# EAGLE schematic binary_watch_v0 (EAGLE 6.5.0)
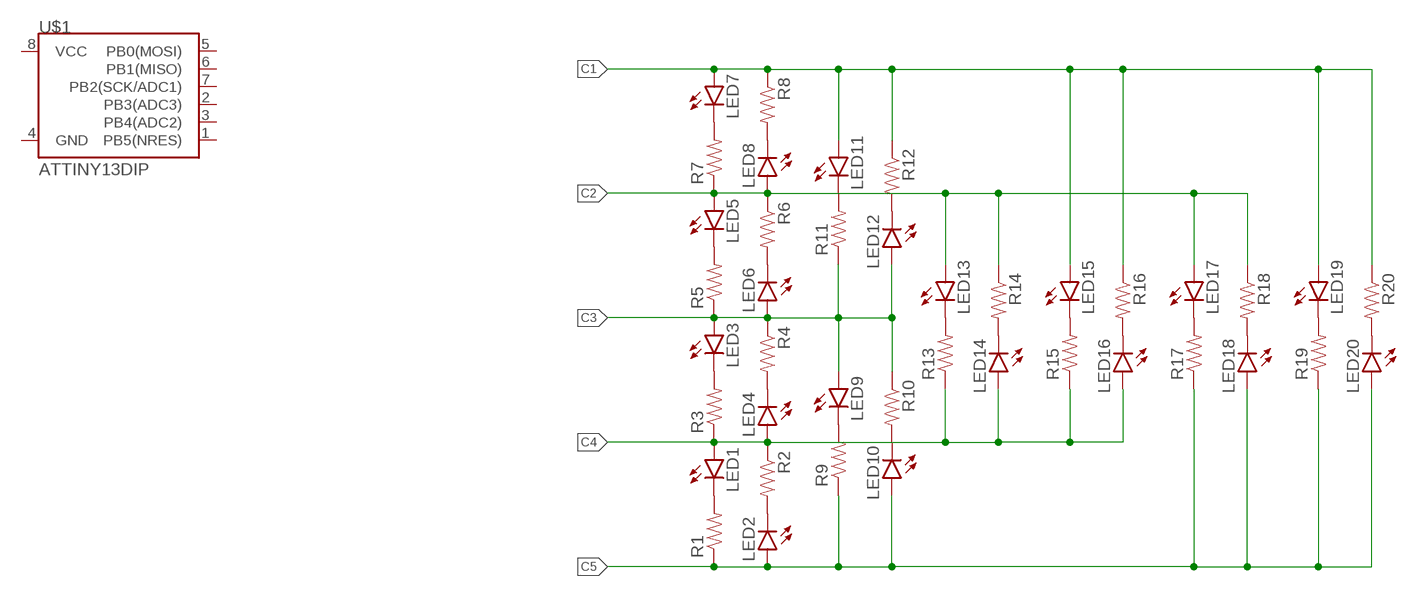
[diagram p0: schematic, sheet 1]

## Parts
LED1  LED0603  [LED-0603]
LED2  LED0603  [LED-0603]
LED3  LED0603  [LED-0603]
LED4  LED0603  [LED-0603]
LED5  LED0603  [LED-0603]
LED6  LED0603  [LED-0603]
LED7  LED0603  [LED-0603]
LED8  LED0603  [LED-0603]
LED9  LED0603  [LED-0603]
LED10  LED0603  [LED-0603]
LED11  LED0603  [LED-0603]
LED12  LED0603  [LED-0603]
LED13  LED0603  [LED-0603]
LED14  LED0603  [LED-0603]
LED15  LED0603  [LED-0603]
LED16  LED0603  [LED-0603]
LED17  LED0603  [LED-0603]
LED18  LED0603  [LED-0603]
LED19  LED0603  [LED-0603]
LED20  LED0603  [LED-0603]
R1  RESISTOR0603-RES  [0603-RES]
R2  RESISTOR0603-RES  [0603-RES]
R3  RESISTOR0603-RES  [0603-RES]
R4  RESISTOR0603-RES  [0603-RES]
R5  RESISTOR0603-RES  [0603-RES]
R6  RESISTOR0603-RES  [0603-RES]
R7  RESISTOR0603-RES  [0603-RES]
R8  RESISTOR0603-RES  [0603-RES]
R9  RESISTOR0603-RES  [0603-RES]
R10  RESISTOR0603-RES  [0603-RES]
R11  RESISTOR0603-RES  [0603-RES]
R12  RESISTOR0603-RES  [0603-RES]
R13  RESISTOR0603-RES  [0603-RES]
R14  RESISTOR0603-RES  [0603-RES]
R15  RESISTOR0603-RES  [0603-RES]
R16  RESISTOR0603-RES  [0603-RES]
R17  RESISTOR0603-RES  [0603-RES]
R18  RESISTOR0603-RES  [0603-RES]
R19  RESISTOR0603-RES  [0603-RES]
R20  RESISTOR0603-RES  [0603-RES]
U$1  ATTINY13DIP  [DIP08]

## Nets
C1: LED7.A LED11.A LED15.A LED19.A R8.1 R12.1 R16.1 R20.1
C2: LED5.A LED8.A LED13.A LED17.A R6.1 R7.1 R14.1 R18.1
C3: LED3.A LED6.A LED9.A LED12.A R4.1 R5.1 R10.1 R11.1
C4: LED1.A LED4.A LED14.A LED16.A R2.1 R3.1 R13.1 R15.1
C5: LED2.A LED10.A LED18.A LED20.A R1.1 R9.1 R17.1 R19.1
N$1: LED1.C R1.2
N$2: LED2.C R2.2
N$3: LED3.C R3.2
N$4: LED4.C R4.2
N$5: LED5.C R5.2
N$6: LED6.C R6.2
N$7: LED8.C R8.2
N$8: LED7.C R7.2
N$9: LED9.C R9.2
N$10: LED10.C R10.2
N$11: LED11.C R11.2
N$12: LED12.C R12.2
N$13: LED13.C R13.2
N$14: LED14.C R14.2
N$15: LED15.C R15.2
N$17: LED16.C R16.2
N$24: LED17.C R17.2
N$25: LED18.C R18.2
N$28: LED19.C R19.2
N$29: LED20.C R20.2
Unconnected: U$1.1(PB5(NRES)) U$1.2(PB3(ADC3)) U$1.3(PB4(ADC2)) U$1.4(GND) U$1.5(PB0(MOSI)) U$1.6(PB1(MISO)) U$1.7(PB2(SCK/ADC1)) U$1.8(VCC)

## Library data of the parts
LED1-LED20 = SparkFun-LED:LED: LEDs Standard schematic elements and footprints for 5mm, 3mm, 1206, and 0603 sized LEDs. 5mm - Spark Fun Electronics SKU : COM-00529 (and others)
R1-R20 = SparkFun-Resistors:RESISTOR: Resistor Basic schematic elements and footprints for 0603, 1206, and PTH resistors.
U$1 = SparkFun-DigitalIC:ATTINY13: Atmel 8-pin 1kB flash uC